# Altium schematic sheet 2228_Emetteur_Alimentation.SchDoc
size A3; Author: Miguel Santos; CompanyName: ETML-ES; Organization: ETML-ES; Address1: Avenue Recordon 1; Address2: 1004 Lausanne; Address3: Switzerland; Revision: A; SheetNumber: 1; SheetTotal: 2; Version: 1.0
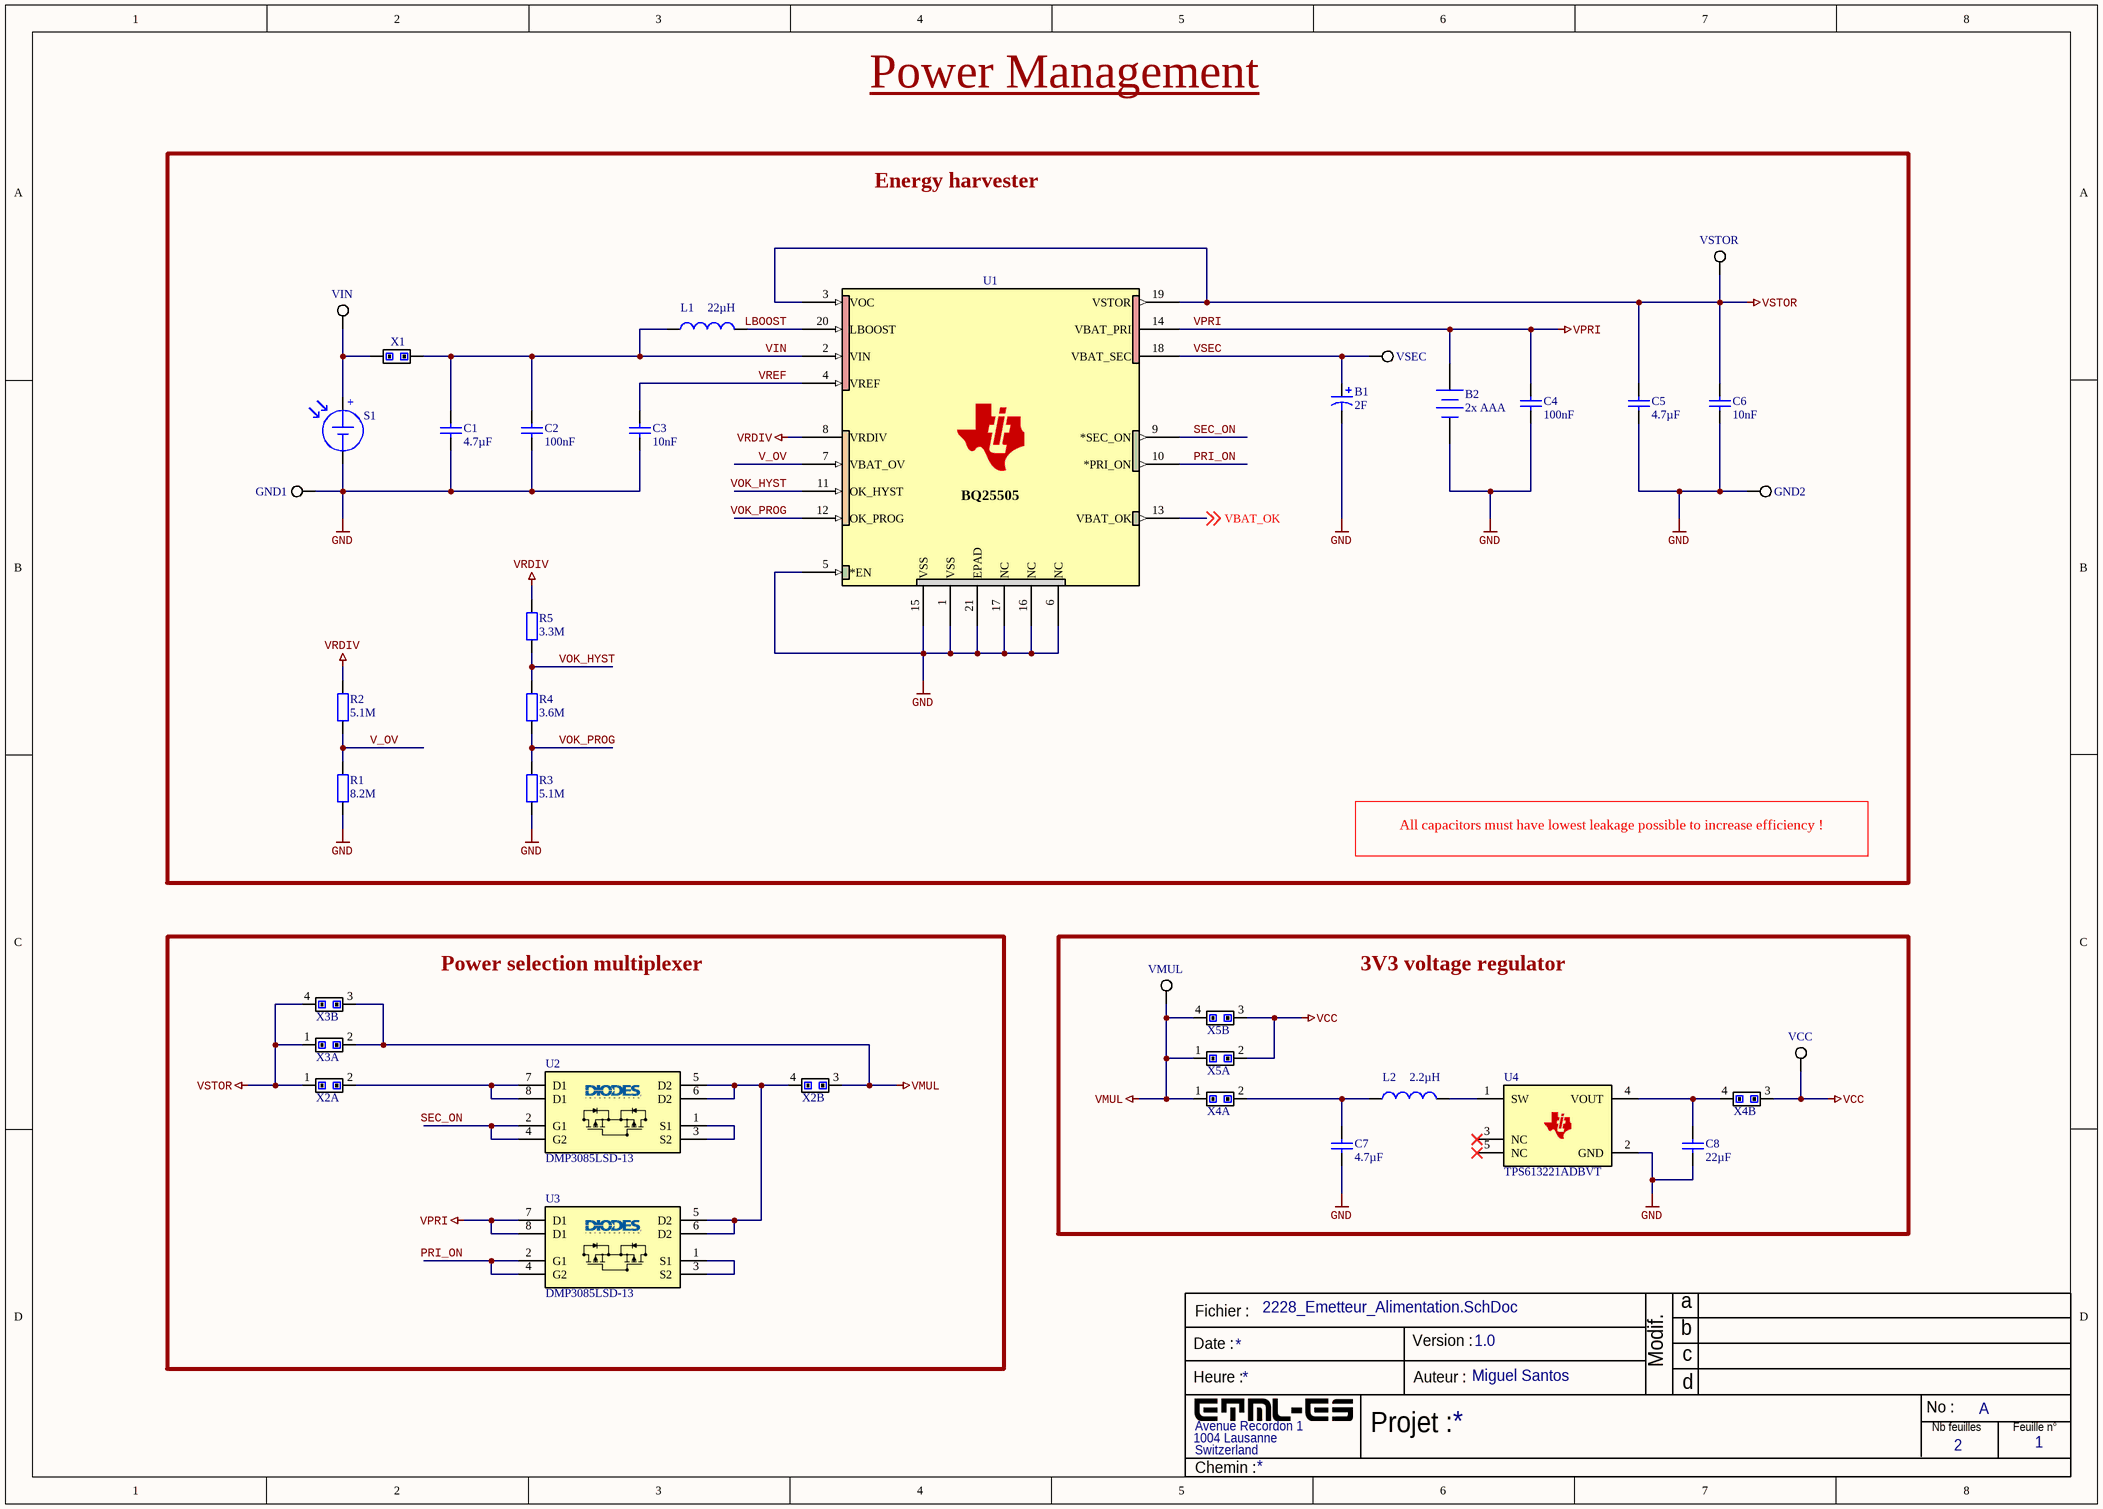
[diagram p0: 2228_Emetteur_Alimentation.SchDoc]

## Parts
B1  value 2F  [SuperCap]  (hidden comment: SUPERCAP)
B2  2x AAA  [WE_2PINS]
C1  value 4.7µF  [CAP_0805]  (hidden comment: CAP_SMD)
C2  value 100nF  [CAP_0805]  (hidden comment: CAP_SMD)
C3  value 10nF  [CAP_0805]  (hidden comment: CAP_SMD)
C4  value 100nF  [CAP_0805]  (hidden comment: CAP_SMD)
C5  value 4.7µF  [CAP_0805]  (hidden comment: CAP_SMD)
C6  value 10nF  [CAP_0805]  (hidden comment: CAP_SMD)
C7  value 4.7µF  [CAP_0805]  (hidden comment: CAP_SMD)
C8  value 22µF  [CAP_0805]  (hidden comment: CAP_SMD)
GND1  5019  [KSTN-5019_V]  (value not drawn)
GND2  5019  [KSTN-5019_V]  (value not drawn)
L1  value 22µH  [WE-LQFS_4828]  (hidden comment: IND_SMD)
L2  value 2.2µH  [IND_0805]  (hidden comment: IND_SMD)
R1  value 8.2M  [RES_0805]  (hidden comment: RES_SMD)
R2  value 5.1M  [RES_0805]  (hidden comment: RES_SMD)
R3  value 5.1M  [RES_0805]  (hidden comment: RES_SMD)
R4  value 3.6M  [RES_0805]  (hidden comment: RES_SMD)
R5  value 3.3M  [RES_0805]  (hidden comment: RES_SMD)
S1  Solar_Cell  [KXOB25-05X3F-TR]  (value not drawn)
U1  BQ25505  [QFN_25505]  (value not drawn)
U2  DMP3085LSD-13  [SO-8]
U3  DMP3085LSD-13  [SO-8]
U4  TPS613221ADBVT  [SOT95P280X145-5N]
VCC  5019  [KSTN-5019_V]  (value not drawn)
VIN  5019  [KSTN-5019_V]  (value not drawn)
VMUL  5019  [KSTN-5019_V]  (value not drawn)
VSEC  5019  [KSTN-5019_V]  (value not drawn)
VSTOR  5019  [KSTN-5019_V]  (value not drawn)
X1  2PIN_HEADER  [HEADER_2PINS]  (value not drawn)
X2  2X2PIN_HEADER  [2x2_HEADER]  (value not drawn)  (parts A,B of 2)
X3  2X2PIN_HEADER  [2x2_HEADER]  (value not drawn)  (parts A,B of 2)
X4  2X2PIN_HEADER  [2x2_HEADER]  (value not drawn)  (parts A,B of 2)
X5  2X2PIN_HEADER  [2x2_HEADER]  (value not drawn)  (parts A,B of 2)

## Blocks framed on the sheet
Energy harvester: B1 B2 C1-C6 GND1 GND2 L1 R1-R5 S1 U1 VIN VSEC VSTOR X1
Power selection multiplexer: U2 U3 X2 X3
3V3 voltage regulator: C7 C8 L2 U4 VCC VMUL X4 X5

## Nets
GND: B1.2 B2.2 C1.1 C2.1 C3.2 C4.1 C5.1 C6.1 C7.1 C8.1 GND1.1 GND2.1 R1.2 R3.2 S1.2(-) U1.1(VSS) U1.5(*EN) U1.6(NC) U1.15(VSS) U1.16(NC) U1.17(NC) U1.21(EPAD) U4.2(GND)
VCC: VCC.1 X4.3 X5.2 X5.3
VMUL: VMUL.1 X2.3 X3.2 X3.3 X4.1 X5.1 X5.4
VPRI: B2.1 C4.2 U1.14(VBAT_PRI) U3.7(D1) U3.8(D1)
VRDIV: R2.1 R5.1 U1.8(VRDIV)
VSTOR: C5.2 C6.2 U1.3(VOC) U1.19(VSTOR) VSTOR.1 X2.1 X3.1 X3.4
LBOOST: L1.2 U1.20(LBOOST)
PRI_ON: U1.10(*PRI_ON) U3.2(G1) U3.4(G2)
SEC_ON: U1.9(*SEC_ON) U2.2(G1) U2.4(G2)
V_OV: R1.1 R2.2 U1.7(VBAT_OV)
VBAT_OK: U1.13(VBAT_OK) ; off-sheet VBAT_OK
VIN: C1.2 C2.2 L1.1 U1.2(VIN) X1.2
VOK_HYST: R4.1 R5.2 U1.11(OK_HYST)
VOK_PROG: R3.1 R4.2 U1.12(OK_PROG)
VREF: C3.1 U1.4(VREF)
VSEC: B1.1 U1.18(VBAT_SEC) VSEC.1
NetC7_2: C7.2 L2.1 X4.2
NetC8_2: C8.2 U4.4(VOUT) X4.4
NetL2_2: L2.2 U4.1(SW)
NetS1_1: S1.1(+) VIN.1 X1.1
NetU2_1: U2.1(S1) U2.3(S2)
NetU2_5: U2.5(D2) U2.6(D2) U3.5(D2) U3.6(D2) X2.4
NetU2_7: U2.7(D1) U2.8(D1) X2.2
NetU3_1: U3.1(S1) U3.3(S2)

Not connected (* = marked no-connect by the designer): U4 3(NC)* 5(NC)*

## Notes on the sheet
- Power Management
- All capacitors must have lowest leakage possible to increase efficiency !
- Fichier :
- a
- Date :
- Heure :
- Version :
- Auteur :
- Modif.
- b
- c
- d
- Projet :
- No :
- Nb feuilles
- Feuille n°
- Chemin :

## Library data of the parts
B1 = SUPERCAP: Polarized SuperCapacitor (Radial); Supplier 1: Digi-Key; Supplier Part Number 1: 338-DSF205Q3R0-ND
B2 = Battery: Multicell Battery
C1-C8 = CAP_SMD: Capacitor
GND1 GND2 VCC VIN VMUL VSEC VSTOR = CMP-1672-00008-1: Test Point, 1 Position SMD, RoHS, Tape and Reel; ComponentLink1Description: Manufacturer URL; Package Quantity: 1000; DatasheetVersion: 03/2014; Packaging: Tape and Reel; ComponentLink2URL: http://www.keyelco.com/product-pdf.cfm?p=1357; ComponentLink1URL: http://www.keyelco.com/; Mount: Surface Mount; Contact Plating: Silver; PackageDescription: 1-Pin Surface Mount Device, Body 3.81 x 2.03 mm; Pins: 1; RoHSCompliant: True; Mounting Technology: Surface Mount; ComponentLink2Description: Datasheet; PackageReference: 5019
L1 L2 = IND_SMD: Inductor SMD; Manufacturer: *; Manufacturer_Number: *; Supplier 1: Digi-Key
  L1: Supplier Part Number 1: 732-10821-1-ND
  L2: Supplier Part Number 1: 587-2043-1-ND
S1 = Solar_Cell: Anysolar KXOB25-05X3F; Manufacturer: Anysolar; Manufacturer_PN: KXOB25-05X3F-TR; Supplier 1: Digi-Key; Supplier Part Number 1: 2994-KXOB25-05X3TF-TRCT-ND
U1 = BQ25505RGRR: Low power energy harvester; Manufacturer: Texas Instruments; Manufacturer_Number: BQ25505RGRR; Supplier 1: Digi-Key; Supplier Part Number 1: 296-37078-1-ND
U2 U3 = DMP3085LSD-13: Manufacturer: Diodes Inc; Manufacturer_Number: DMP3085LSD-13; Supplier 1: Digi-Key; Supplier Part Number 1: DMP3085LSD-13DICT-ND
U4 = TPS613221ADBVT: Manufacturer: Texas Instruments; Manufacturer_Number: TPS613221ADBVT
R1-R5 = RES_SMD
  R1: Supplier 1: Digi-Key; Supplier Part Number 1: 541-7.87MHCT-ND